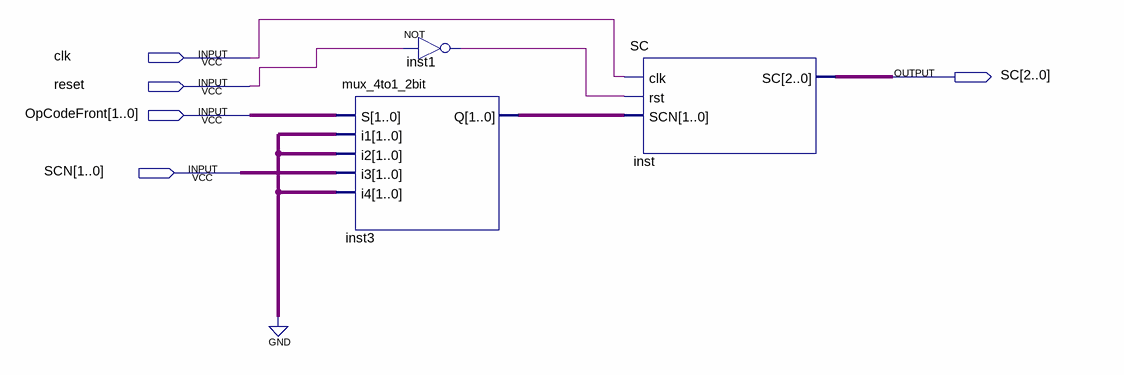
[diagram p0: schematic sheet]
// Quartus schematic SC_Unit.bdf as structural Verilog: 3 symbols, 5 pins
module SC_Unit (
  input  clk,
  input  reset,
  input  [1:0] OpCodeFront,
  input  [1:0] SCN,
  output [2:0] SC
);

  wire inst1_out;
  wire [1:0] inst3_q;

  mux_4to1_2bit inst3 (.S(OpCodeFront), .i1(2'b00), .i2(2'b00), .i3(SCN), .i4(2'b00), .Q(inst3_q));
  not inst1 (inst1_out, reset);
  SC inst (.clk(clk), .rst(inst1_out), .SCN(inst3_q), .SC(SC));
endmodule
